# Altium schematic sheet controller.SchDoc: Controller
size A4; Author: Samuel López; DocumentNumber: 2; SheetNumber: 2; SheetTotal: 6
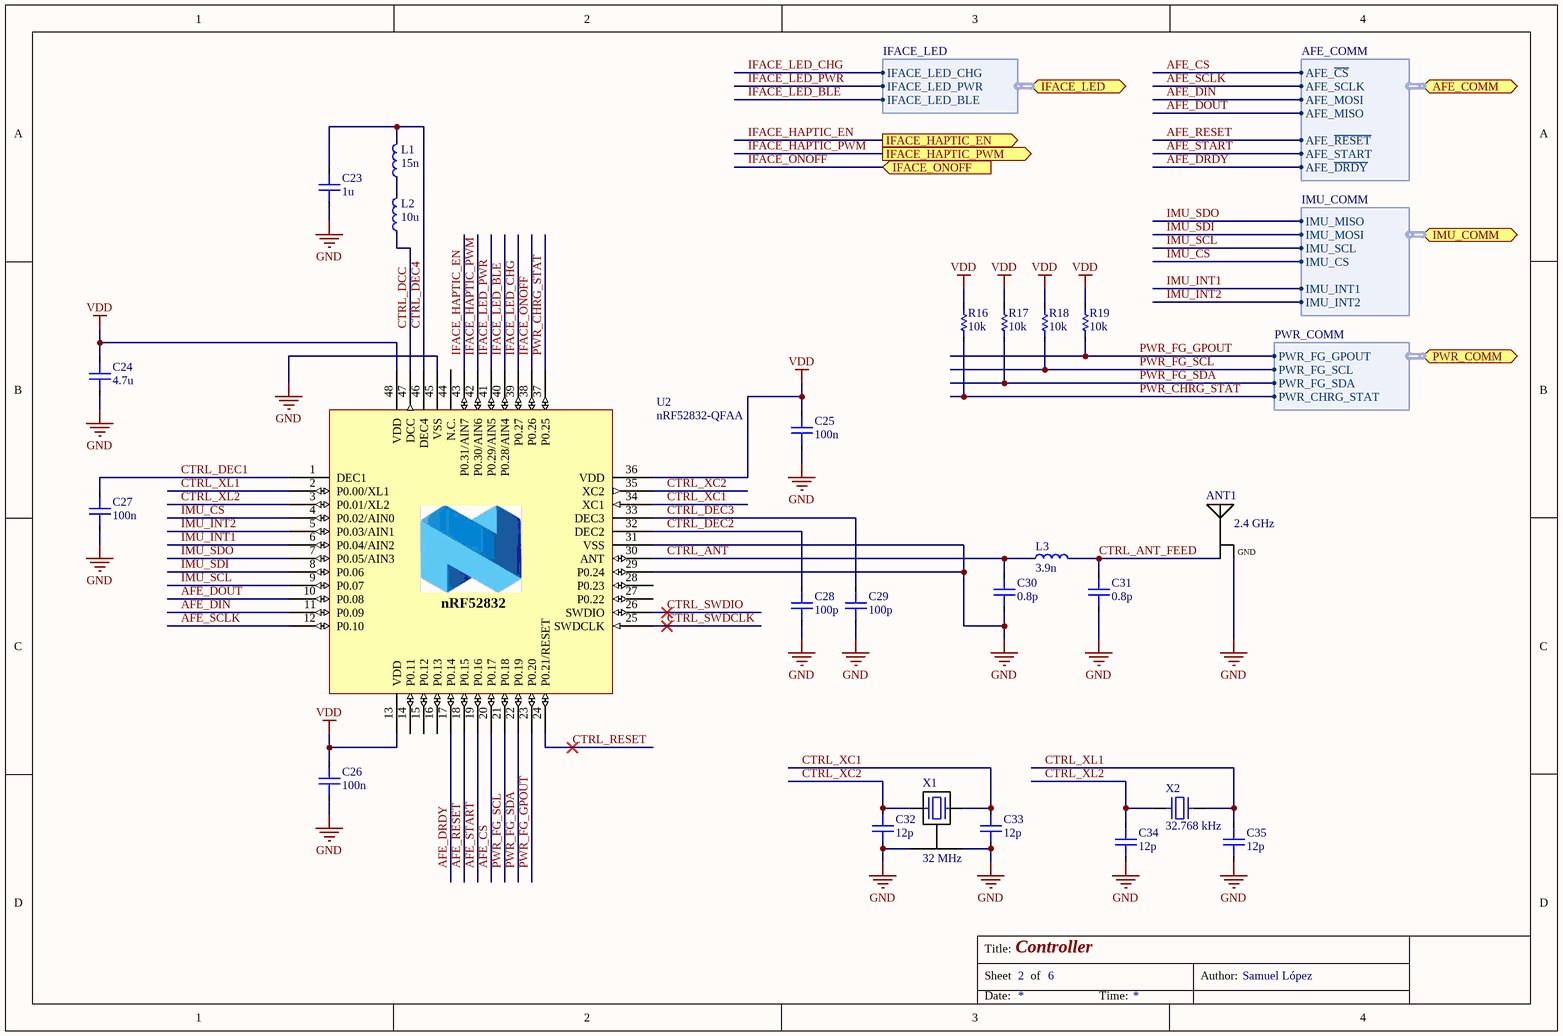
[diagram p0: controller.SchDoc]

## Parts
ANT1  2.4 GHz  [ANT2.4GHZ_MIFA]  (net tie, no BOM)
C23  1u  [C0402]
C24  4.7u  [C0603]
C25  100n  [C0402]
C26  100n  [C0402]
C27  100n  [C0402]
C28  100p  [C0402]
C29  100p  [C0402]
C30  0.8p  [C0402]
C31  0.8p  [C0402]
C32  12p  [C0402]
C33  12p  [C0402]
C34  12p  [C0402]
C35  12p  [C0402]
L1  15n  [L0402]
L2  10u  [L0603]
L3  3.9n  [L0402]
R16  10k  [R0402]
R17  10k  [R0402]
R18  10k  [R0402]
R19  10k  [R0402]
U2  nRF52832-QFAA  [QFN40P600X600X90-48N]
X1  32 MHz  [CX2016DB32000D0FLJCC]
X2  32.768 kHz  [ABS07-32.768KHZ-9-T]

## Ports
AFE_COMM (harness AFE_COMM), IFACE_HAPTIC_EN (out), IFACE_HAPTIC_PWM (out), IFACE_LED (harness IFACE_LED), IFACE_ONOFF (in), IMU_COMM (harness IMU_COMM), PWR_COMM (harness PWR_COMM)

## Harnesses
IFACE_LED: IFACE_LED_CHG, IFACE_LED_PWR, IFACE_LED_BLE
AFE_COMM: AFE_SCLK, AFE_MOSI, AFE_MISO, AFE_~{CS}, AFE_~{RESET}, AFE_START, AFE_~{DRDY}
IMU_COMM: IMU_SCL, IMU_MOSI, IMU_MISO, IMU_CS, IMU_INT1, IMU_INT2
PWR_COMM: PWR_FG_GPOUT, PWR_FG_SCL, PWR_FG_SDA, PWR_CHRG_STAT

## Nets
GND: ANT1.2(GND) C23.1 C24.1 C25.1 C26.1 C27.1 C28.1 C29.1 C30.2 C31.2 C32.1 C33.1 C34.1 C35.1 U2.29(P0.24) U2.31(VSS) U2.45(VSS) U2.49(GND) X1.2 X1.4
VDD: C24.2 C25.2 C26.2 R16.2 R17.2 R18.2 R19.2 U2.13(VDD) U2.36(VDD) U2.48(VDD)
AFE_CS: U2.20(P0.17) ; port AFE_COMM.AFE_~{CS}
AFE_DIN: U2.11(P0.09) ; port AFE_COMM.AFE_MOSI
AFE_DOUT: U2.10(P0.08) ; port AFE_COMM.AFE_MISO
AFE_DRDY: U2.17(P0.14) ; port AFE_COMM.AFE_~{DRDY}
AFE_RESET: U2.18(P0.15) ; port AFE_COMM.AFE_~{RESET}
AFE_SCLK: U2.12(P0.10) ; port AFE_COMM.AFE_SCLK
AFE_START: U2.19(P0.16) ; port AFE_COMM.AFE_START
CTRL_ANT: C30.1 L3.1 U2.30(ANT)
CTRL_ANT_FEED: ANT1.1(IN) C31.1 L3.2
CTRL_DCC: L2.1 U2.47(DCC)
CTRL_DEC1: C27.2 U2.1(DEC1)
CTRL_DEC2: C28.2 U2.32(DEC2)
CTRL_DEC3: C29.2 U2.33(DEC3)
CTRL_DEC4: C23.2 L1.2 U2.46(DEC4)
CTRL_RESET: U2.24(P0.21/RESET)
CTRL_SWDCLK: U2.25(SWDCLK)
CTRL_SWDIO: U2.26(SWDIO)
CTRL_XC1: C33.2 U2.34(XC1) X1.3
CTRL_XC2: C32.2 U2.35(XC2) X1.1
CTRL_XL1: C35.2 U2.2(P0.00/XL1) X2.2
CTRL_XL2: C34.2 U2.3(P0.01/XL2) X2.1
IFACE_HAPTIC_EN: U2.43(P0.31/AIN7) ; port IFACE_HAPTIC_EN
IFACE_HAPTIC_PWM: U2.42(P0.30/AIN6) ; port IFACE_HAPTIC_PWM
IFACE_LED_BLE: U2.40(P0.28/AIN4) ; port IFACE_LED.IFACE_LED_BLE
IFACE_LED_CHG: U2.39(P0.27) ; port IFACE_LED.IFACE_LED_CHG
IFACE_LED_PWR: U2.41(P0.29/AIN5) ; port IFACE_LED.IFACE_LED_PWR
IFACE_ONOFF: U2.38(P0.26) ; port IFACE_ONOFF
IMU_CS: U2.4(P0.02/AIN0) ; port IMU_COMM.IMU_CS
IMU_INT1: U2.6(P0.04/AIN2) ; port IMU_COMM.IMU_INT1
IMU_INT2: U2.5(P0.03/AIN1) ; port IMU_COMM.IMU_INT2
IMU_SCL: U2.9(P0.07) ; port IMU_COMM.IMU_SCL
IMU_SDI: U2.8(P0.06) ; port IMU_COMM.IMU_MOSI
IMU_SDO: U2.7(P0.05/AIN3) ; port IMU_COMM.IMU_MISO
PWR_CHRG_STAT: R16.1 U2.37(P0.25) ; port PWR_COMM.PWR_CHRG_STAT
PWR_FG_GPOUT: R19.1 U2.23(P0.20) ; port PWR_COMM.PWR_FG_GPOUT
PWR_FG_SCL: R18.1 U2.21(P0.18) ; port PWR_COMM.PWR_FG_SCL
PWR_FG_SDA: R17.1 U2.22(P0.19) ; port PWR_COMM.PWR_FG_SDA
NetL1_1: L1.1 L2.2

Not connected (* = marked no-connect by the designer): U2 14(P0.11) 15(P0.12) 16(P0.13) 27(P0.22) 28(P0.23) 44(N.C.)

## Notes on the sheet
- Title:
- Sheet
- of
- Author:
- Date:
- Time:
- (in symbol nRF52832_QFAA) nRF52832

## Library data of the parts
ANT1 = Antenna 2.4 GHz: Antenna - Meandered Inverted F Antenna (IFA)
C23-C35 = Capacitor: Rated Voltage: *
  C23: Value: 1u
  C24: Value: 4.7u
  C25-C27: Value: 100n
  C28 C29: Value: 100p
  C30 C31: Value: 0.8p
  C32-C35: Value: 12p
L1-L3 = Inductor
  L1: Value: 15n
  L2: Value: 10u
  L3: Value: 3.9n
R16-R19 = Resistor: Value: 10k; Power: *
U2 = nRF52832_QFAA: Multi-protocol Bluetooth Low Energy, ANT and 2.4GHz proprietary system-on-chip; Manufacturer: Nordic Semiconductor; Artikkelnr Noca: N.A.; Part Number: nRF52832-QFAA; Manufacturer Part Number: nRF52832-QFAA; Datasheet: *; LatestRevisionDate: 2014-11-26; Pin Count: 48; Publisher: Nordic Semiconductor; Published: 2014-11-26; Value: nRF52832-QFAA; Note: *; Supplier: Nordic Semiconductor; Supplier part number: *; 2nd source Supplier: *; 2nd source part number: *; Footprint Doc: QFN-48; Artikkelnr Simpro: N.A.
X1 = CX2016DB32000D0FLJCC: Crystal - 32 MHz, 8 pF, 80 ohm; Supplier 1: Digi-Key; Supplier Part Number 1: 1253-1118-1-ND
X2 = ABS07-32.768KHZ-9-T: Crystal - 32.768 kHz, 9 pF, 70 kOhm; Supplier 1: Digi-Key; Supplier Part Number 1: 535-9544-1-ND